# EAGLE design Espressomaschine (EAGLE 9.6.1)

## Sheet 1 of 4
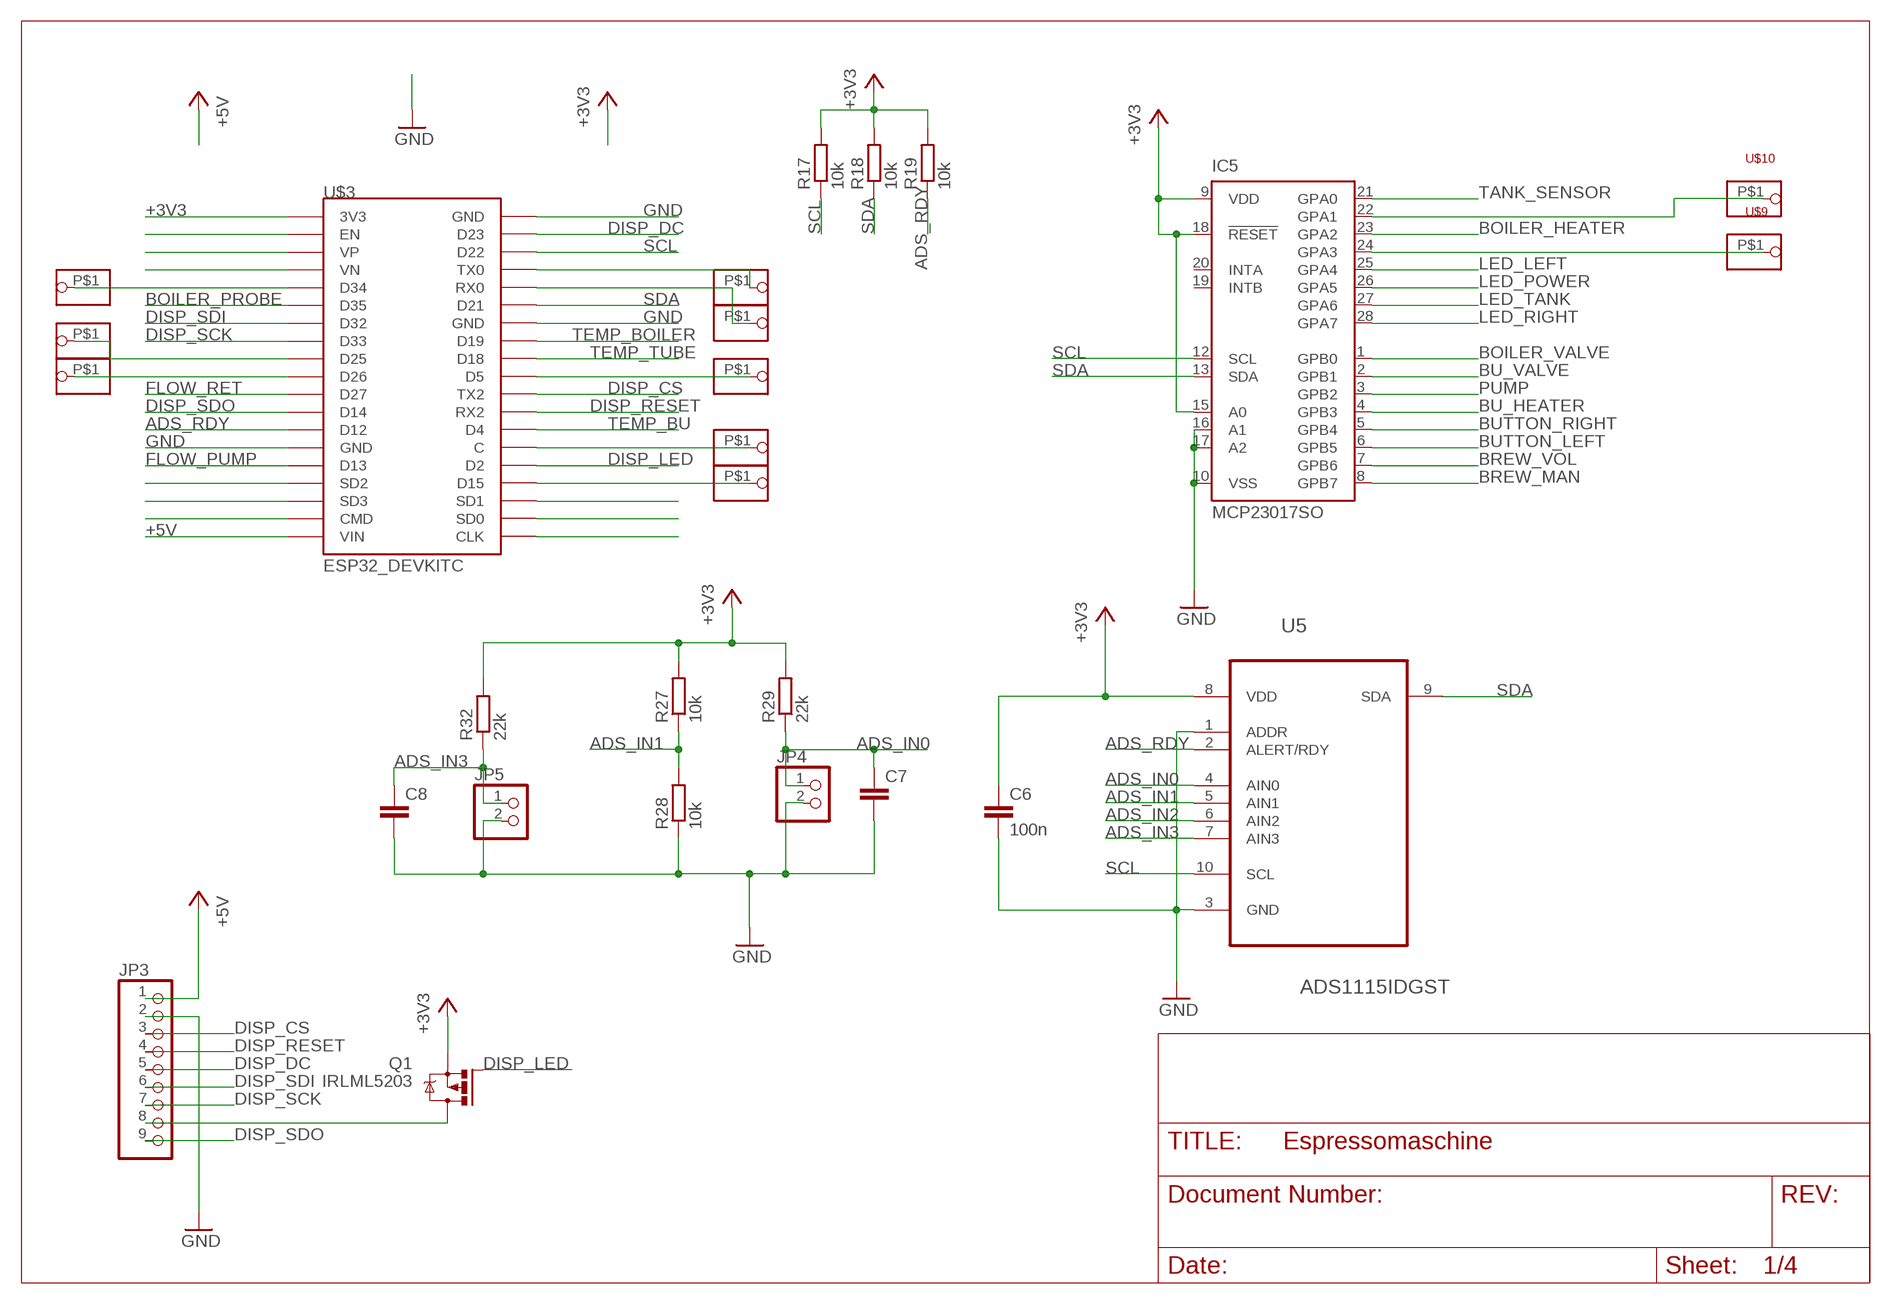
[diagram p0: schematic, sheet 1]

### Parts
C6  100n  C-EUC0603  [C0603]
C7  C-EUC0603  [C0603]
C8  C-EUC0603  [C0603]
IC5  MCP23017SO  [SO28W]
JP3  PINHD-1X9  [1X09]
JP4  PINHD-1X2  [1X02]
JP5  PINHD-1X2  [1X02]
Q1  IRLML5203  [MICRO3]
R17  10k  R-EU_R0603  [R0603]
R18  10k  R-EU_R0603  [R0603]
R19  10k  R-EU_R0603  [R0603]
R27  10k  R-EU_R0603  [R0603]
R28  10k  R-EU_R0603  [R0603]
R29  22k  R-EU_R0603  [R0603]
R32  22k  R-EU_R0603  [R0603]
U5  ADS1115IDGST  [SOP50P490X110-10N]
U$3  ESP32_DEVKITC  [ESP32_DEVKITC]
U$5  PINHD-1X1SMD_RM1.27  [1X01_SMD_RM1.27]
U$6  PINHD-1X1SMD_RM1.27  [1X01_SMD_RM1.27]
U$7  PINHD-1X1SMD_RM1.27  [1X01_SMD_RM1.27]
U$8  PINHD-1X1SMD_RM1.27  [1X01_SMD_RM1.27]
U$9  PINHD-1X1SMD_RM1.27  [1X01_SMD_RM1.27]
U$10  PINHD-1X1SMD_RM1.27  [1X01_SMD_RM1.27]
U$11  PINHD-1X1SMD_RM1.27  [1X01_SMD_RM1.27]
U$12  PINHD-1X1SMD_RM1.27  [1X01_SMD_RM1.27]
U$13  PINHD-1X1SMD_RM1.27  [1X01_SMD_RM1.27]
U$14  PINHD-1X1SMD_RM1.27  [1X01_SMD_RM1.27]

### Nets
+3V3: C6.1 IC5.9(VDD) IC5.15(A0) IC5.18(!RESET) Q1.2(S) R17.2 R18.2 R19.2 R27.2 R29.2 R32.2 U5.8(VDD) U$3.3V3 ; also sheet 2,3,4
+5V: JP3.1 U$3.VIN ; also sheet 2,3,4
ADS_IN0: C7.1 JP4.1 R29.1 U5.4(AIN0)
ADS_IN1: R27.1 R28.2 U5.5(AIN1)
ADS_IN2: U5.6(AIN2) ; also sheet 3
ADS_IN3: C8.1 JP5.1 R32.1 U5.7(AIN3)
ADS_RDY: R19.1 U5.2(ALERT/RDY) U$3.D12
BOILER_HEATER: IC5.23(GPA2) ; also sheet 2
BOILER_PROBE: U$3.D35 ; also sheet 3
BOILER_VALVE: IC5.1(GPB0) ; also sheet 2
BREW_MAN: IC5.8(GPB7) ; also sheet 2
BREW_VOL: IC5.7(GPB6) ; also sheet 2
BU_HEATER: IC5.4(GPB3) ; also sheet 2
BU_VALVE: IC5.2(GPB1) ; also sheet 2
BUTTON_LEFT: IC5.6(GPB5) ; also sheet 2
BUTTON_RIGHT: IC5.5(GPB4) ; also sheet 2
DISP_CS: JP3.3 U$3.TX2
DISP_DC: JP3.5 U$3.D23
DISP_LED: Q1.1(G) U$3.D2
DISP_RESET: JP3.4 U$3.RX2
DISP_SCK: JP3.7 U$3.D33
DISP_SDI: JP3.6 U$3.D32
DISP_SDO: JP3.9 U$3.D14
FLOW_PUMP: U$3.D13 ; also sheet 4
FLOW_RET: U$3.D27 ; also sheet 4
GND: C6.2 C7.2 C8.2 IC5.10(VSS) IC5.16(A1) IC5.17(A2) JP3.2 JP4.2 JP5.2 R28.1 U5.1(ADDR) U5.3(GND) U$3.GND@1(GND) U$3.GND@2(GND) U$3.GND@3(GND) ; also sheet 2,3,4
LED_LEFT: IC5.25(GPA4) ; also sheet 2
LED_POWER: IC5.26(GPA5) ; also sheet 2
LED_RIGHT: IC5.28(GPA7) ; also sheet 2
LED_TANK: IC5.27(GPA6) ; also sheet 2
N$4: U$3.C U$7.P$1
N$8: IC5.22(GPA1) U$10.P$1
N$19: IC5.24(GPA3) U$9.P$1
N$22: U$3.TX0 U$5.P$1
N$24: JP3.8 Q1.3(D)
N$26: U$3.RX0 U$11.P$1
N$31: U$3.D5 U$6.P$1
N$44: U$3.D15 U$8.P$1
N$45: U$3.SD1
N$46: U$3.SD0
N$47: U$3.CLK
N$49: U$3.EN
N$50: U$3.VP
N$51: U$3.VN
N$52: U$3.D34 U$12.P$1
N$56: U$3.D25 U$13.P$1
N$57: U$3.D26 U$14.P$1
N$63: U$3.SD2
N$64: U$3.SD3
N$65: U$3.CMD
PUMP: IC5.3(GPB2) ; also sheet 2
SCL: IC5.12(SCL) R17.1 U5.10(SCL) U$3.D22
SDA: IC5.13(SDA) R18.1 U5.9(SDA) U$3.D21
TANK_SENSOR: IC5.21(GPA0) ; also sheet 2
TEMP_BOILER: U$3.D19 ; also sheet 4
TEMP_BU: U$3.D4 ; also sheet 4
TEMP_TUBE: U$3.D18 ; also sheet 4
Unconnected: IC5.19(INTB) IC5.20(INTA)

## Sheet 2 of 4
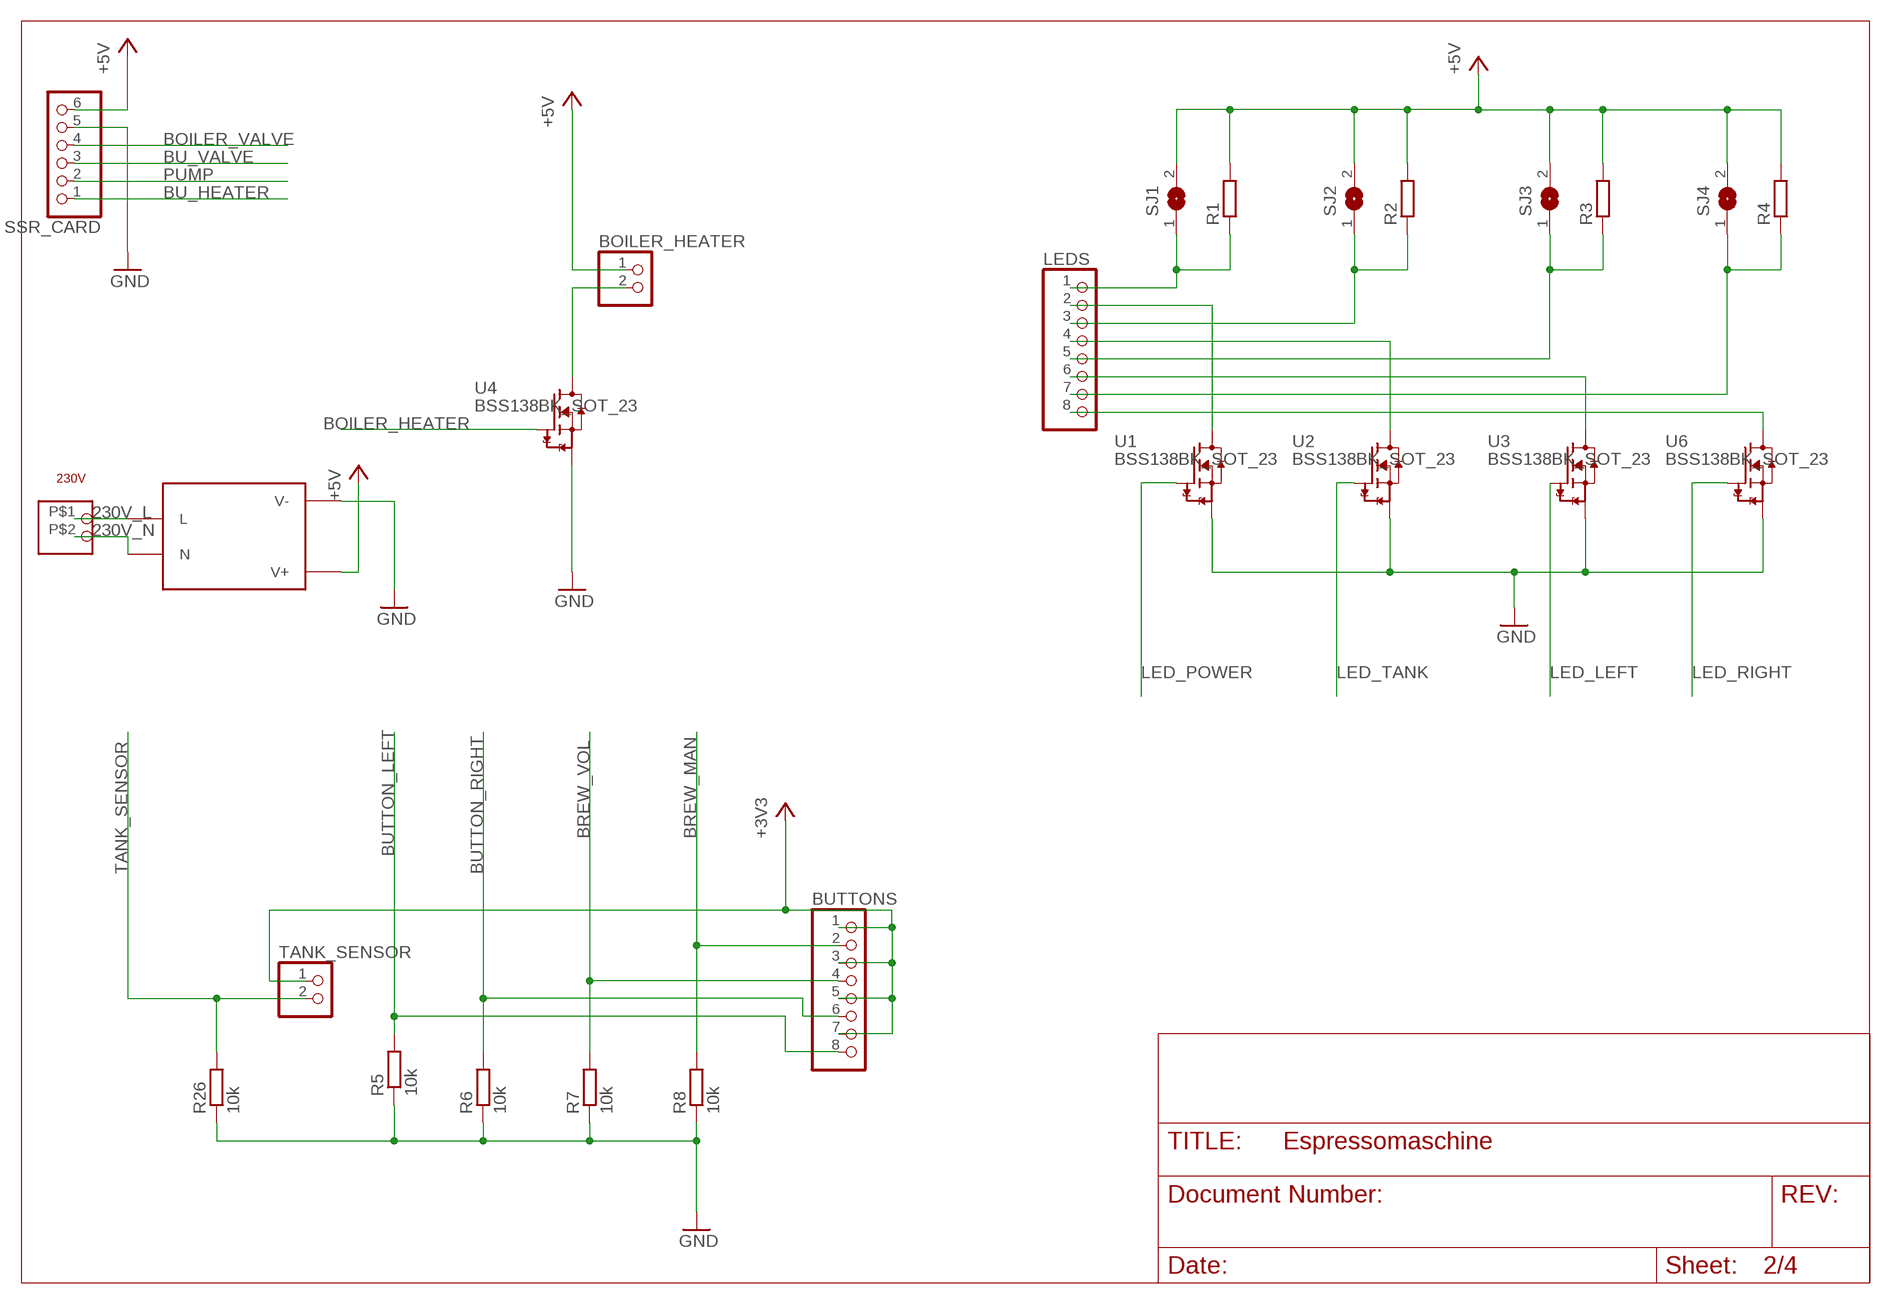
[diagram p1: schematic, sheet 2]

### Parts
230V  1X2RM5  [1X02_RM5]
BOILER_HEATER  PINHD-1X2  [1X02]
BUTTONS  PINHD-1X8  [1X08]
LEDS  PINHD-1X8  [1X08]
R1  R-EU_R0603  [R0603]
R2  R-EU_R0603  [R0603]
R3  R-EU_R0603  [R0603]
R4  R-EU_R0603  [R0603]
R5  10k  R-EU_R0603  [R0603]
R6  10k  R-EU_R0603  [R0603]
R7  10k  R-EU_R0603  [R0603]
R8  10k  R-EU_R0603  [R0603]
R26  10k  R-EU_R0603  [R0603]
SJ1  SJ  [SJ]
SJ2  SJ  [SJ]
SJ3  SJ  [SJ]
SJ4  SJ  [SJ]
SSR_CARD  PINHD-1X6  [1X06]
TANK_SENSOR  PINHD-1X2  [1X02]
U1  BSS138BK_SOT_23  [SOT23]
U2  BSS138BK_SOT_23  [SOT23]
U3  BSS138BK_SOT_23  [SOT23]
U4  BSS138BK_SOT_23  [SOT23]
U6  BSS138BK_SOT_23  [SOT23]
U$1  HLK-PM0X  [HLK-PM0X]

### Nets
230V_L: 230V.P$1 U$1.L
230V_N: 230V.P$2 U$1.N
+3V3: BUTTONS.1 BUTTONS.3 BUTTONS.5 BUTTONS.7 TANK_SENSOR.1 ; also sheet 1,3,4
+5V: BOILER_HEATER.1 R1.2 R2.2 R3.2 R4.2 SJ1.2 SJ2.2 SJ3.2 SJ4.2 SSR_CARD.6 U$1.V+ ; also sheet 1,3,4
BOILER_HEATER: U4.1(G) ; also sheet 1
BOILER_VALVE: SSR_CARD.4 ; also sheet 1
BREW_MAN: BUTTONS.2 R8.2 ; also sheet 1
BREW_VOL: BUTTONS.4 R7.2 ; also sheet 1
BU_HEATER: SSR_CARD.1 ; also sheet 1
BU_VALVE: SSR_CARD.3 ; also sheet 1
BUTTON_LEFT: BUTTONS.8 R5.2 ; also sheet 1
BUTTON_RIGHT: BUTTONS.6 R6.2 ; also sheet 1
GND: R5.1 R6.1 R7.1 R8.1 R26.1 SSR_CARD.5 U1.2(S) U2.2(S) U3.2(S) U4.2(S) U6.2(S) U$1.V- ; also sheet 1,3,4
LED_LEFT: U3.1(G) ; also sheet 1
LED_POWER: U1.1(G) ; also sheet 1
LED_RIGHT: U6.1(G) ; also sheet 1
LED_TANK: U2.1(G) ; also sheet 1
N$1: LEDS.1 R1.1 SJ1.1
N$2: LEDS.3 R2.1 SJ2.1
N$3: LEDS.5 R3.1 SJ3.1
N$5: LEDS.8 U6.3(D)
N$6: LEDS.6 U3.3(D)
N$7: BOILER_HEATER.2 U4.3(D)
N$9: LEDS.7 R4.1 SJ4.1
N$21: LEDS.4 U2.3(D)
N$23: LEDS.2 U1.3(D)
PUMP: SSR_CARD.2 ; also sheet 1
TANK_SENSOR: R26.2 TANK_SENSOR.2 ; also sheet 1

## Sheet 3 of 4
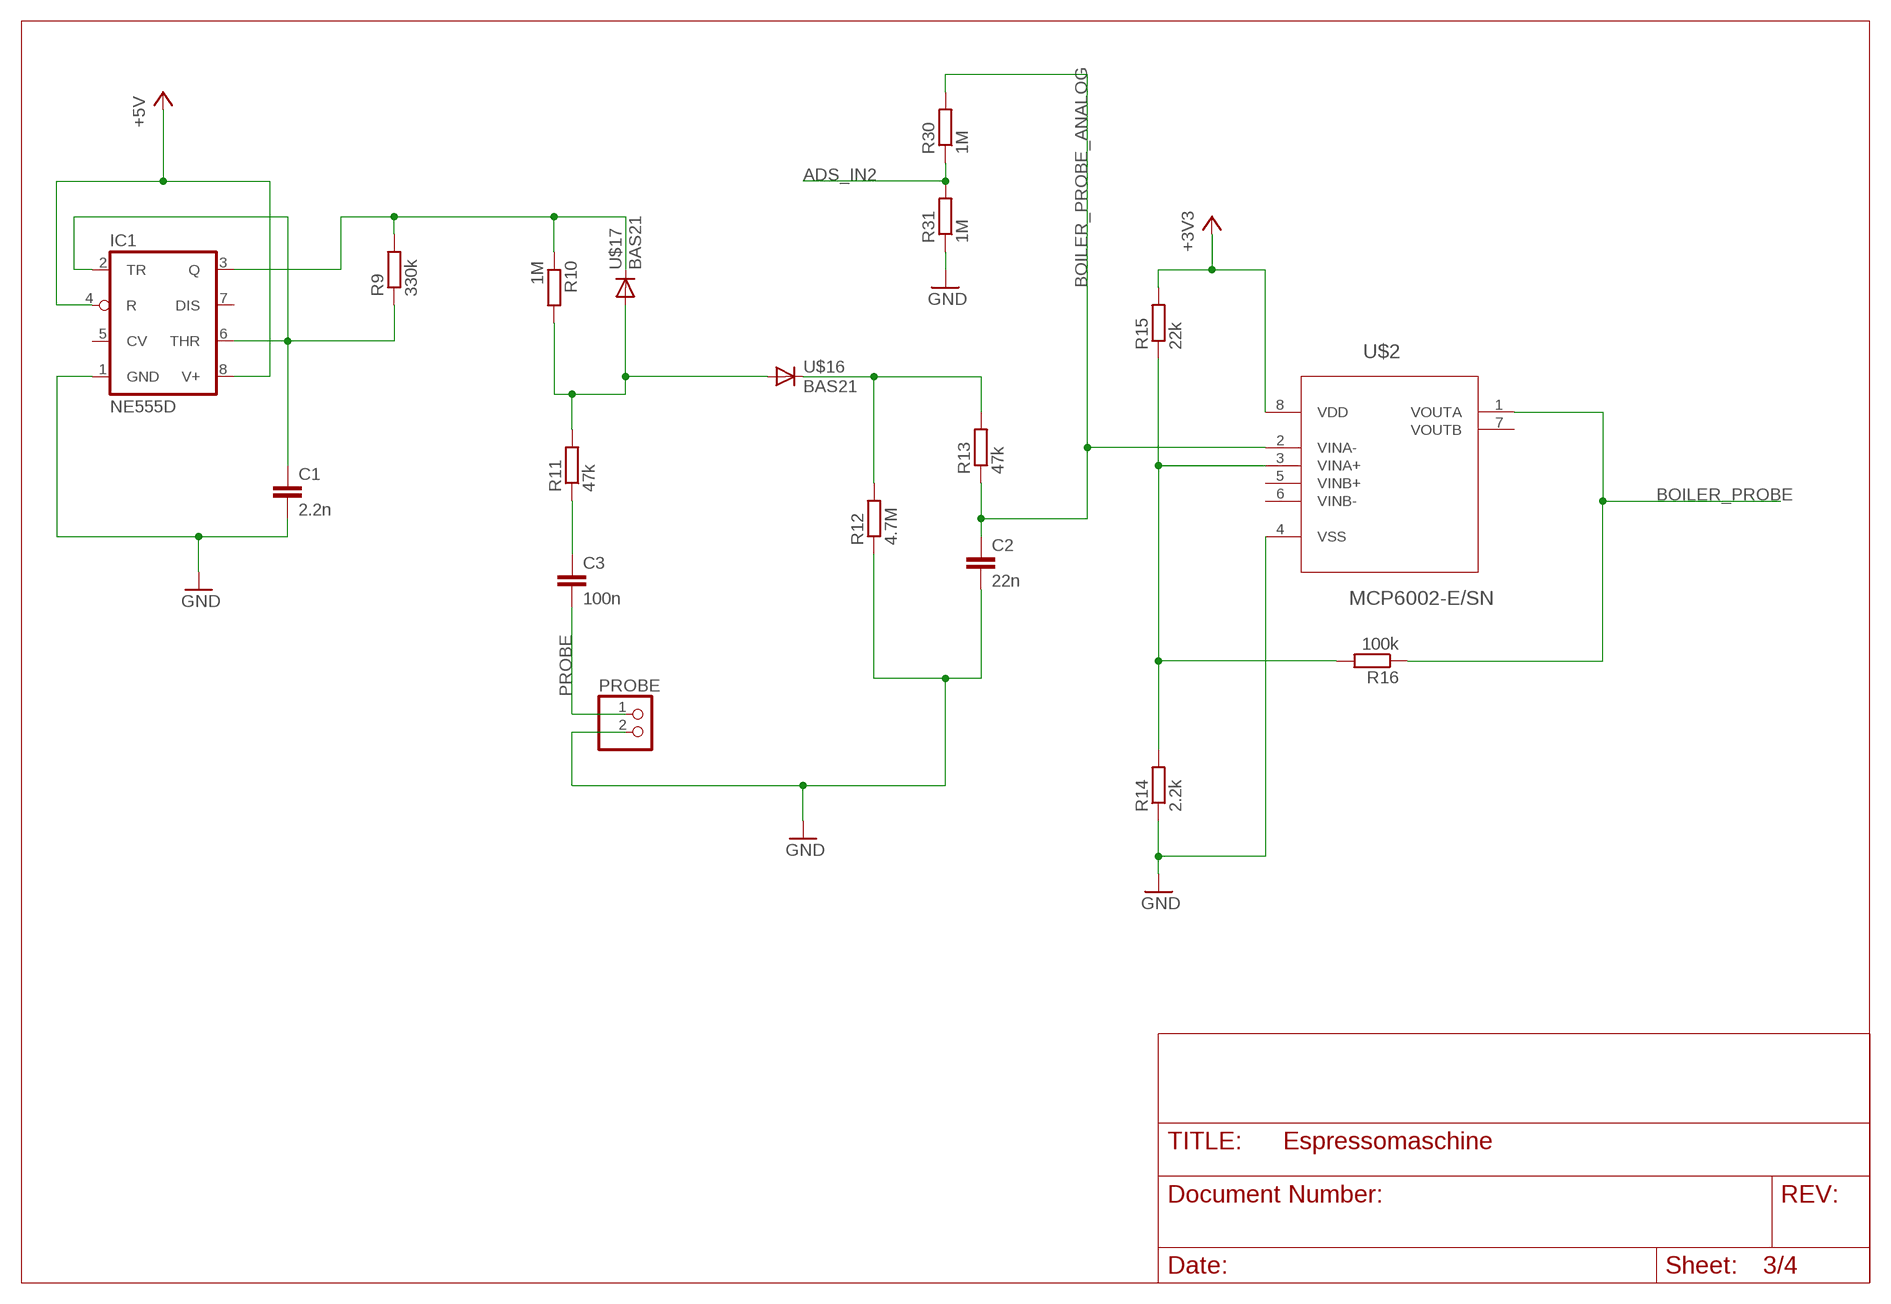
[diagram p2: schematic, sheet 3]

### Parts
C1  2.2n  C-EUC0603  [C0603]
C2  22n  C-EUC0603  [C0603]
C3  100n  C-EUC0603  [C0603]
IC1  NE555D  [SO08]
PROBE  PINHD-1X2  [1X02]
R9  330k  R-EU_R0603  [R0603]
R10  1M  R-EU_R0603  [R0603]
R11  47k  R-EU_R0603  [R0603]
R12  4.7M  R-EU_R0603  [R0603]
R13  47k  R-EU_R0603  [R0603]
R14  2.2k  R-EU_R0603  [R0603]
R15  22k  R-EU_R0603  [R0603]
R16  100k  R-EU_R0603  [R0603]
R30  1M  R-EU_R0603  [R0603]
R31  1M  R-EU_R0603  [R0603]
U$2  MCP6002-E/SN  [SOIC127P600X175-8N]
U$16  BAS21  [SOT23]
U$17  BAS21  [SOT23]

### Nets
+3V3: R15.2 U$2.8(VDD) ; also sheet 1,2,4
+5V: IC1.4(R) IC1.8(V+) ; also sheet 1,2,4
ADS_IN2: R30.1 R31.2 ; also sheet 1
BOILER_PROBE: R16.1 U$2.1(VOUTA) ; also sheet 1
BOILER_PROBE_ANALOG: C2.1 R13.1 R30.2 U$2.2(VINA-)
GND: C1.2 C2.2 IC1.1(GND) PROBE.2 R12.1 R14.1 R31.1 U$2.4(VSS) ; also sheet 1,2,4
N$10: C1.1 IC1.2(TR) IC1.6(THR) R9.1
N$11: R10.2 R11.2 U$16.1(A) U$17.1(A)
N$12: C3.1 R11.1
N$13: IC1.3(Q) R9.2 R10.1 U$17.3(C)
N$14: R12.2 R13.2 U$16.3(C)
N$16: R14.2 R15.1 R16.2 U$2.3(VINA+)
PROBE: C3.2 PROBE.1
Unconnected: IC1.5(CV) IC1.7(DIS) U$2.5(VINB+) U$2.6(VINB-) U$2.7(VOUTB)

## Sheet 4 of 4
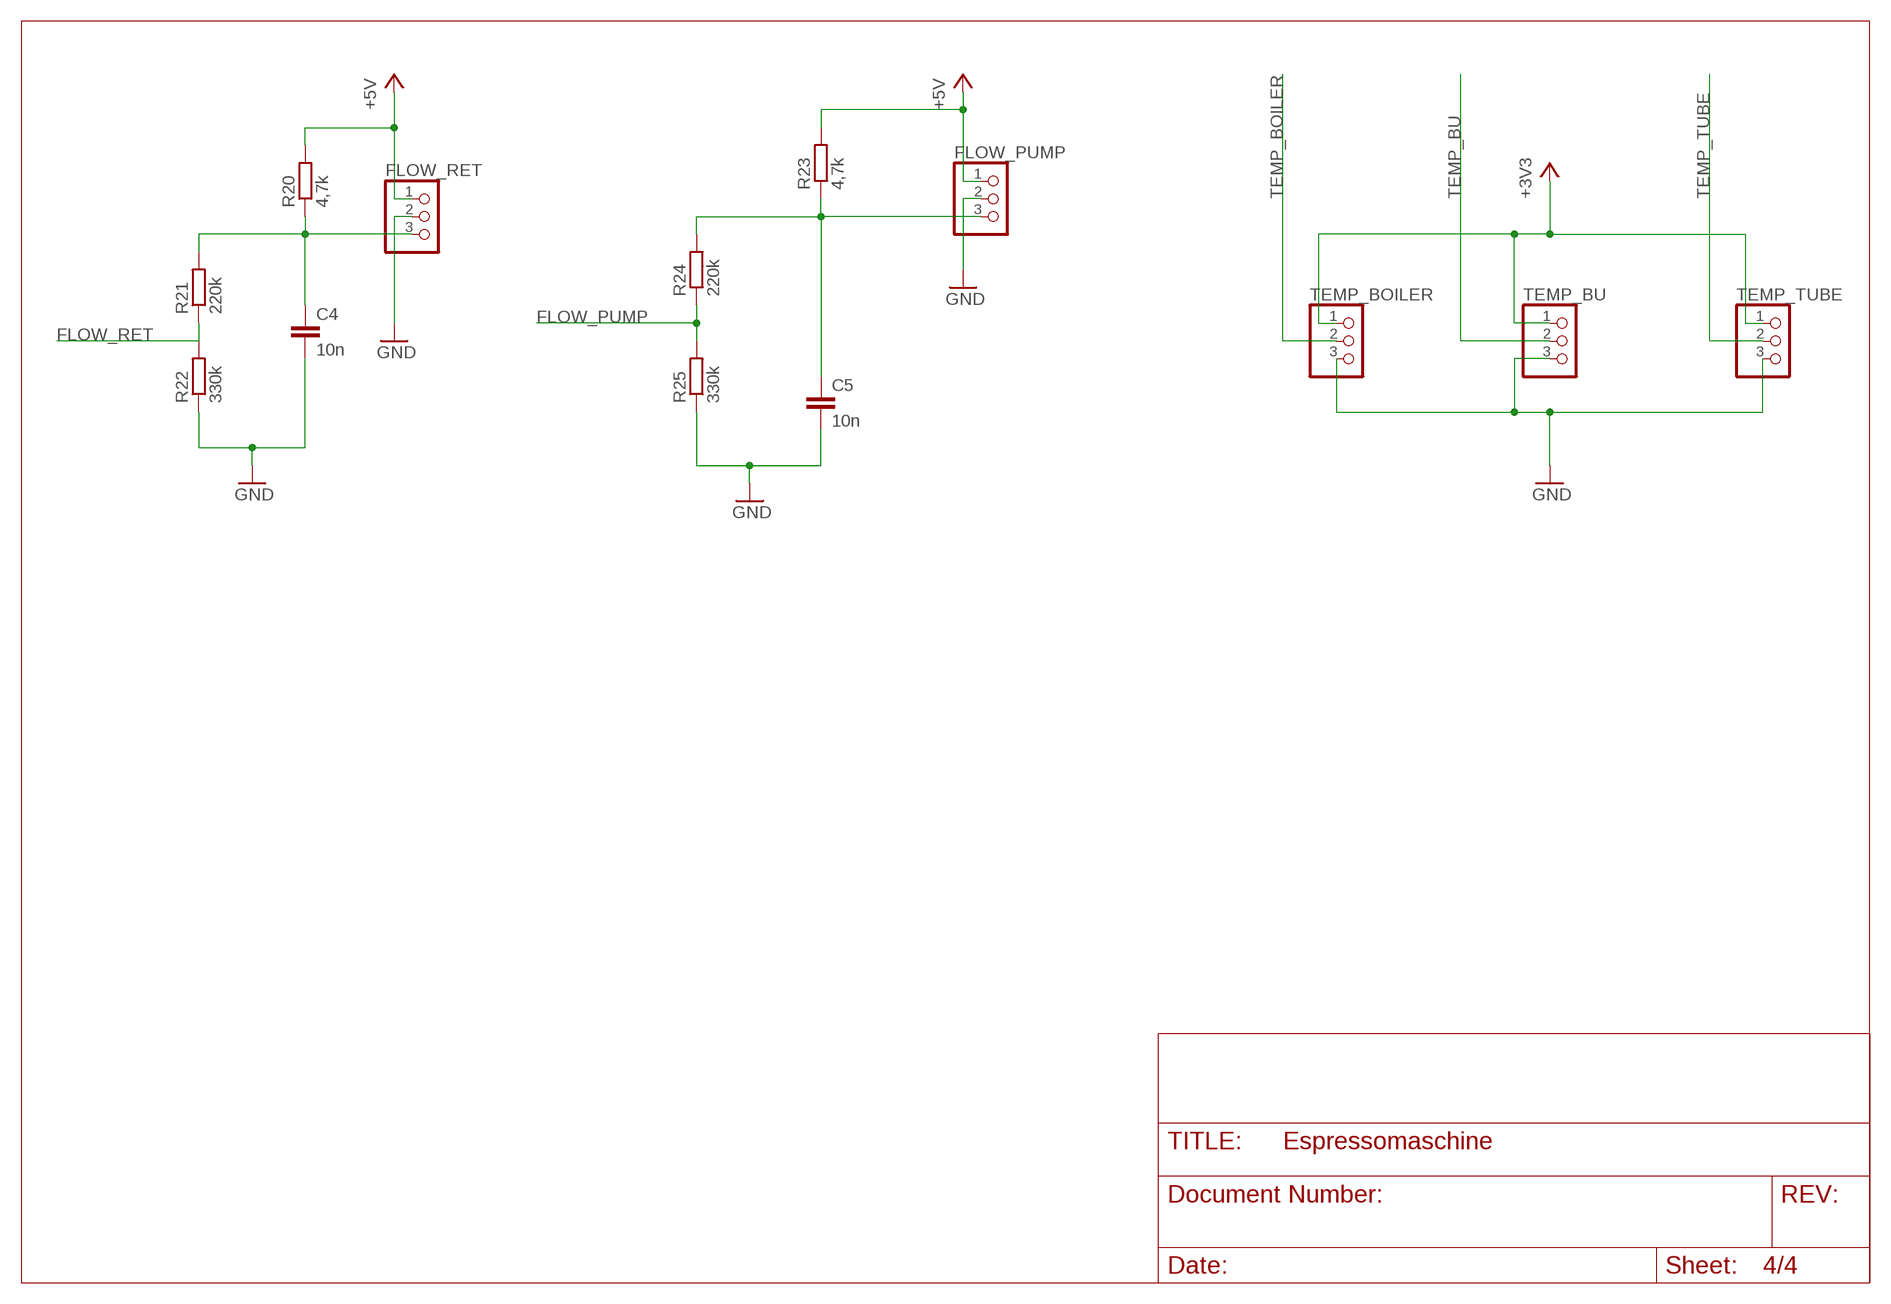
[diagram p3: schematic, sheet 4]

### Parts
C4  10n  C-EUC0603  [C0603]
C5  10n  C-EUC0603  [C0603]
FLOW_PUMP  PINHD-1X3  [1X03]
FLOW_RET  PINHD-1X3  [1X03]
R20  4,7k  R-EU_R0603  [R0603]
R21  220k  R-EU_R0603  [R0603]
R22  330k  R-EU_R0603  [R0603]
R23  4,7k  R-EU_R0603  [R0603]
R24  220k  R-EU_R0603  [R0603]
R25  330k  R-EU_R0603  [R0603]
TEMP_BOILER  PINHD-1X3  [1X03]
TEMP_BU  PINHD-1X3  [1X03]
TEMP_TUBE  PINHD-1X3  [1X03]

### Nets
+3V3: TEMP_BOILER.1 TEMP_BU.1 TEMP_TUBE.1 ; also sheet 1,2,3
+5V: FLOW_PUMP.1 FLOW_RET.1 R20.2 R23.2 ; also sheet 1,2,3
FLOW_PUMP: R24.1 R25.2 ; also sheet 1
FLOW_RET: R21.1 R22.2 ; also sheet 1
GND: C4.2 C5.2 FLOW_PUMP.2 FLOW_RET.2 R22.1 R25.1 TEMP_BOILER.3 TEMP_BU.3 TEMP_TUBE.3 ; also sheet 1,2,3
N$32: C4.1 FLOW_RET.3 R20.1 R21.2
N$33: C5.1 FLOW_PUMP.3 R23.1 R24.2
TEMP_BOILER: TEMP_BOILER.2 ; also sheet 1
TEMP_BU: TEMP_BU.2 ; also sheet 1
TEMP_TUBE: TEMP_TUBE.2 ; also sheet 1

## Library data of the parts
230V = PINHD_eigen:1X2RM5
BOILER_HEATER JP4 JP5 PROBE TANK_SENSOR = pinhead:PINHD-1X2: PIN HEADER
BUTTONS LEDS = pinhead:PINHD-1X8: PIN HEADER
C1-C8 = rcl:C-EU: CAPACITOR, European symbol; SPICEPREFIX: C
FLOW_PUMP FLOW_RET TEMP_BOILER TEMP_BU TEMP_TUBE = pinhead:PINHD-1X3: PIN HEADER
IC1 = linear:*555: TIMER
IC5 = microchip:MCP23017: http://ww1.microchip.com/downloads/en/DeviceDoc/21952a.pdf Source: http://ww1.microchip.com/downloads/en/DeviceDoc/21952a.pdf; MF: MICROCHIP; MPN: MCP23017-E/SO; OC_FARNELL: 1332087; OC_NEWARK: 31K2958
JP3 = pinhead:PINHD-1X9: PIN HEADER
Q1 = transistor-power:IRLML5203: HEXFET P-Channel Power MOSFET
R1-R32 = rcl:R-EU_: RESISTOR, European symbol; SPICEPREFIX: R
SJ1-SJ4 = jumper:SJ: SMD solder JUMPER
SSR_CARD = pinhead:PINHD-1X6: PIN HEADER
U1-U4 U6 = Transistor:BSS138BK: N-channel Trench MOSFET
U5 = Texas Instruments_By_element14_Batch_1:ADS1115IDGST: Analog-to-Digital Converter with Internal Reference; MPN: ADS1115IDGST; OC_FARNELL: 1762981; OC_NEWARK: 25R1241; PACKAGE: MSOP-10; SUPPLIER: Texas Instruments
U$1 = Power:HLK-PM0X: 230VAC to 5V/3.3V/12V DC converter
U$2 = Microchip_By_element14_Batch_1:MCP6002-E/SN: Low-Power Op Amp; DESCRIPTION: Low-Power Op Amp; MPN: MCP6002-E/SN; OC_FARNELL: 1332118; OC_NEWARK: 34M7473; PACKAGE: SOIC-8; SUPPLIER: Microchip
U$3 = ESP32:ESP32_DEVKITC: ESP32 DEVKIT BOARD
U$5-U$14 = PINHD_eigen:PINHD-1X1
U$16 U$17 = Diode:BAS21

## Board
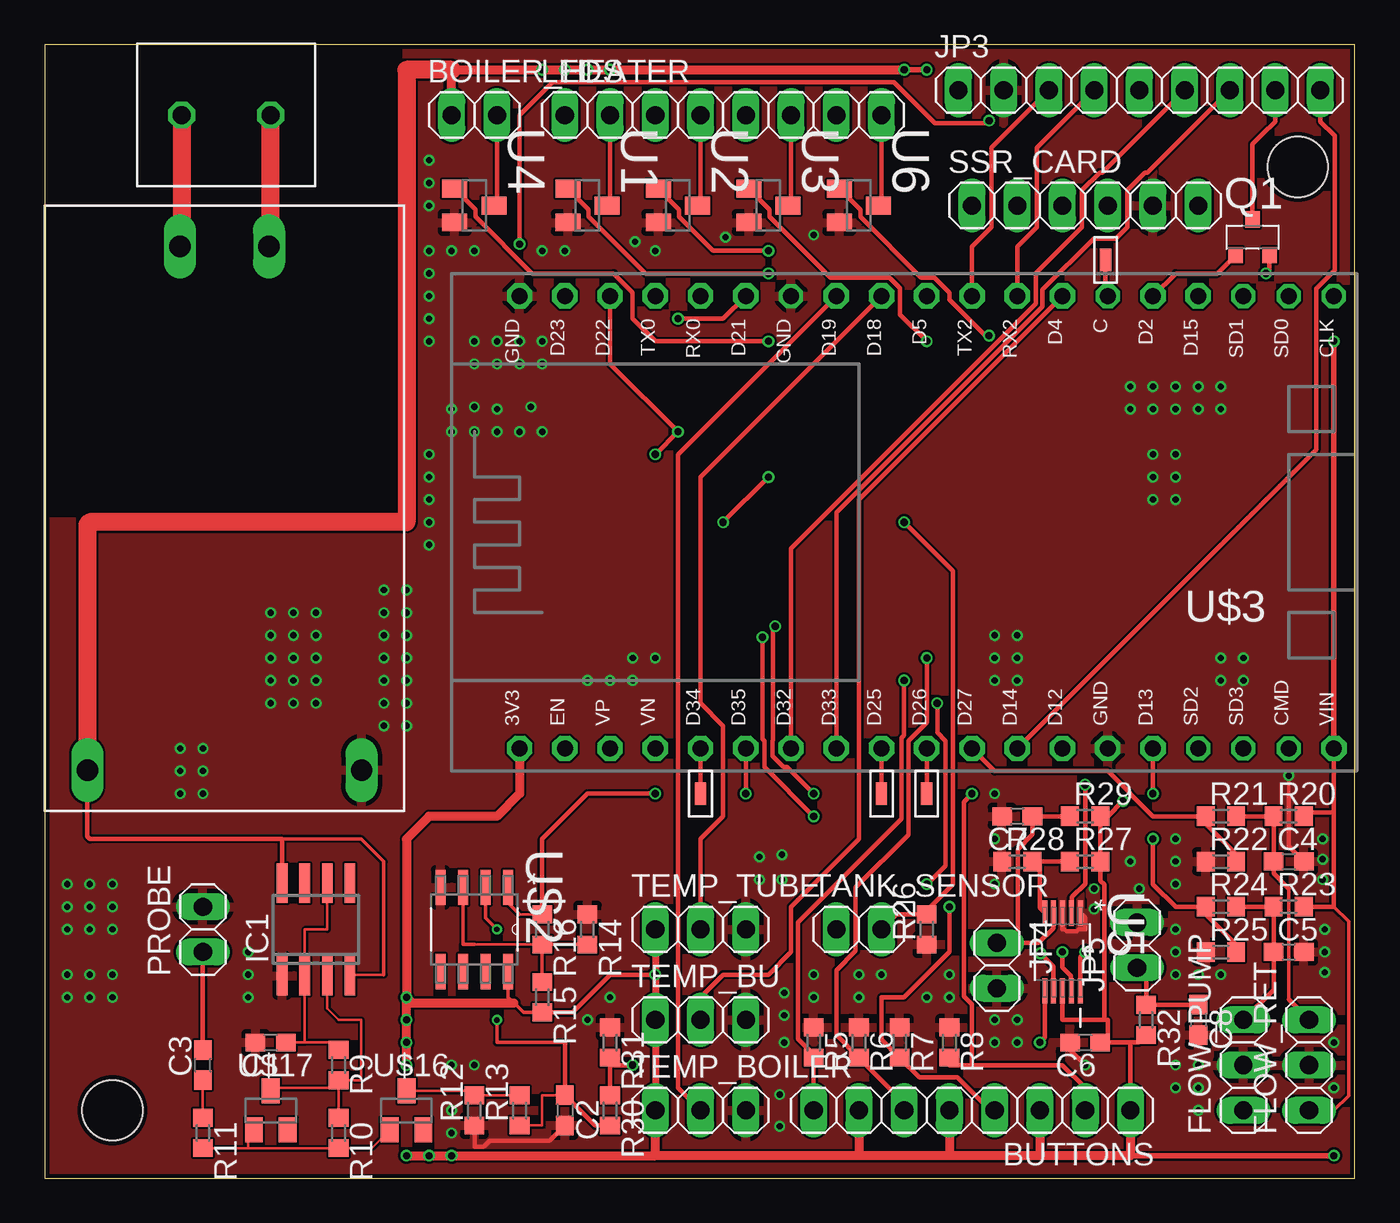
[diagram p4: board, top side]
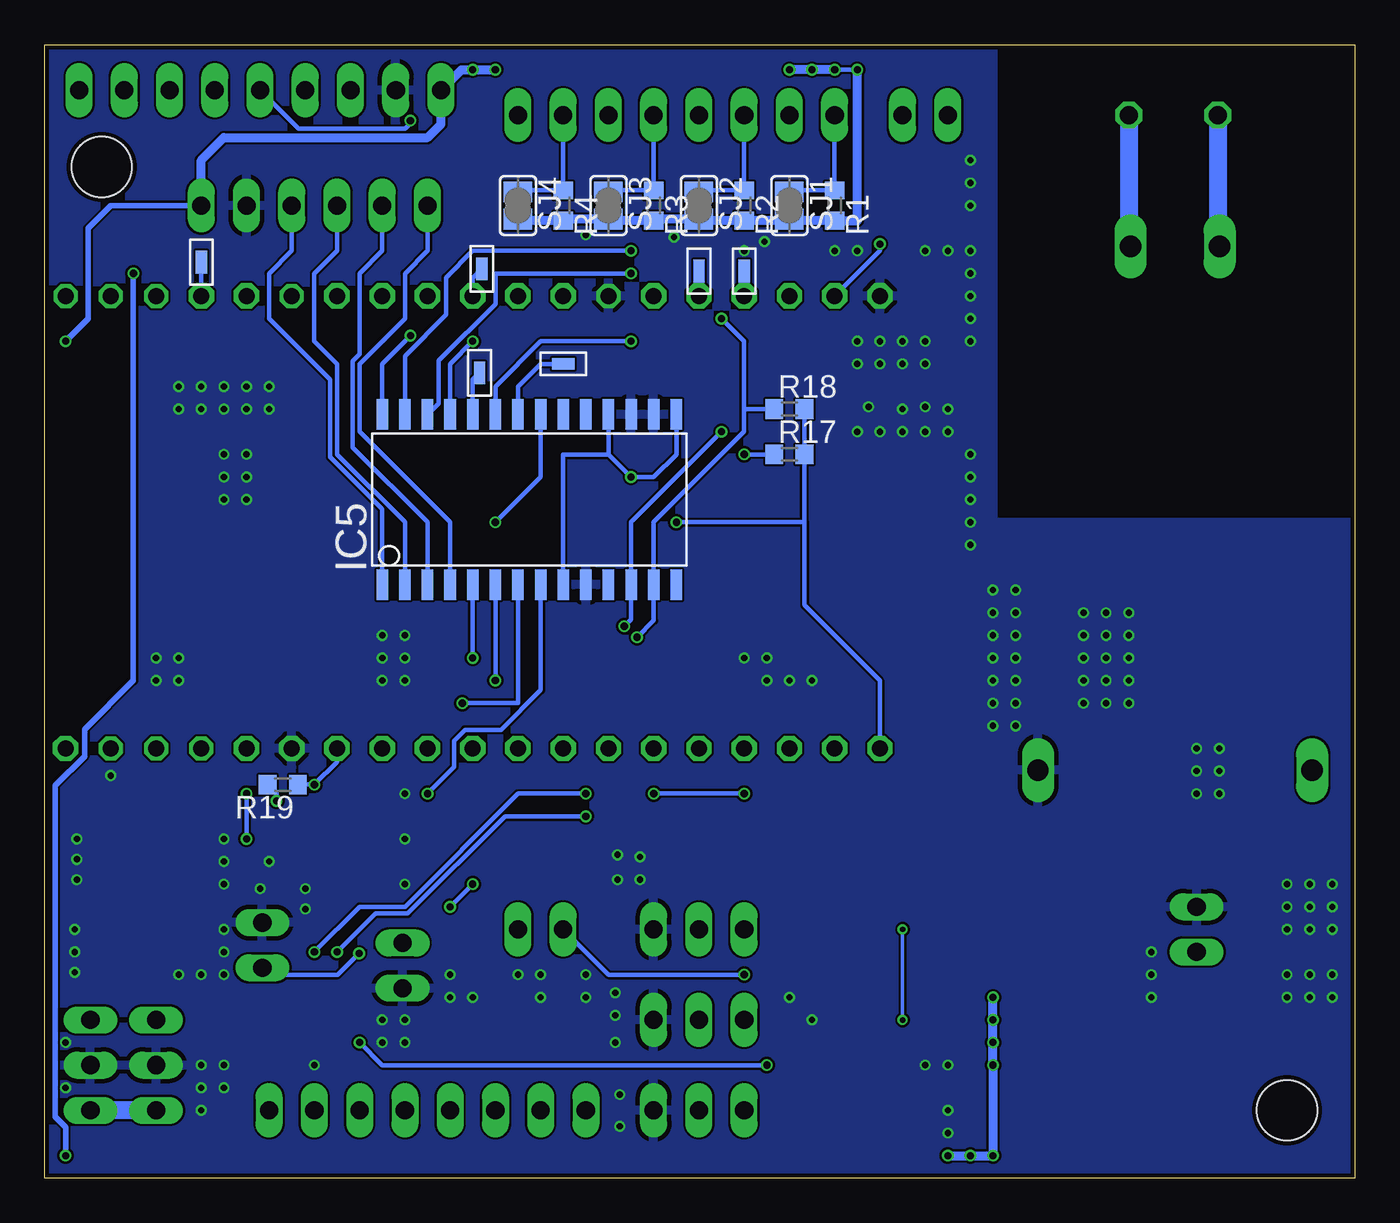
[diagram p5: board, bottom side, seen from below]

Size 73.57 x 63.65 mm. Coordinates in mm from the lower left corner, seen from the top.
Outline: 0,0 73.57,0 73.57,63.65 0,63.65 0,0
Copper layers (1*16): Top 0.035mm / dielectric 1.5mm / Bottom 0.035mm
Design rules "JLCpcb_2_layer *": minimum track width 5mil, minimum drill 0.2mm, track to track 5mil, track to pad 0.2mm, pad to pad 5mil, via to via 0.28mm, smd to smd 0mil, copper to edge 10mil, drill to drill 10mil, minimum pad ring 0.13mm, minimum via ring 0.13mm, stop-mask expansion 0.05mm, vias tented up to drill 100mil, thermal gap 10mil
Holes 3.4 mm at 3.81,3.81 70.36,56.77

### Footprints (pad centres in the part's own frame; a part is rotated, then mirrored left to right if it is on the bottom)
1X02_RM5 = drill 1 octagon: P$1 0,0; P$2 5,0
1X02 = drill 1.016 long: 1 -1.27,0; 2 1.27,0
1X08 = drill 1.016 long: 1 -8.89,0; 2 -6.35,0; 3 -3.81,0; 4 -1.27,0; 5 1.27,0; 6 3.81,0; 7 6.35,0; 8 8.89,0
C0603 = smd 1.1 x 1: 1 -0.85,0; 2 0.85,0
1X03 = drill 1.016 long: 1 -2.54,0; 2 0,0; 3 2.54,0
SO08 = smd 0.6 x 2.2: 1 -1.905,-2.6; 2 -0.635,-2.6; 3 0.635,-2.6; 4 1.905,-2.6; 5 1.905,2.6; 6 0.635,2.6; 7 -0.635,2.6; 8 -1.905,2.6
SO28W = smd 0.65 x 1.7: 1 -7.62,-4.78; 2 -6.35,-4.78; 3 -5.08,-4.78; 4 -3.81,-4.78; 5 -2.54,-4.78; 6 -1.27,-4.78; 7 0,-4.78; 8 1.27,-4.78; 9 2.54,-4.78; 10 3.81,-4.78; 11 5.08,-4.78; 12 6.35,-4.78; 13 7.62,-4.78; 14 8.89,-4.78; 15 8.89,4.78; 16 7.62,4.78; 17 6.35,4.78; 18 5.08,4.78; 19 3.81,4.78; 20 2.54,4.78; 21 1.27,4.78; 22 0,4.78; 23 -1.27,4.78; 24 -2.54,4.78; 25 -3.81,4.78; 26 -5.08,4.78; 27 -6.35,4.78; 28 -7.62,4.78
1X09 = drill 1.016 long: 1 -10.16,0; 2 -7.62,0; 3 -5.08,0; 4 -2.54,0; 5 0,0; 6 2.54,0; 7 5.08,0; 8 7.62,0; 9 10.16,0
MICRO3 = smd 0.8 x 0.9: 1 -0.95,-1; 2 0.95,-1; 3 0,1
R0603 = smd 1 x 1.1: 1 -0.85,0; 2 0.85,0
SJ = smd 1.168 x 1.6: 1 -0.762,0; 2 0.762,0
1X06 = drill 1.016 long: 1 -6.35,0; 2 -3.81,0; 3 -1.27,0; 4 1.27,0; 5 3.81,0; 6 6.35,0
SOT23 = smd 1 x 1.4: 1 -0.95,-1.1; 2 0.95,-1.1; 3 0,1.1
SOP50P490X110-10N = smd 1.422 x 0.279: 1 -2.184,0.991; 2 -2.184,0.508; 3 -2.184,0; 4 -2.184,-0.508; 5 -2.184,-0.991; 6 2.184,-0.991; 7 2.184,-0.508; 8 2.184,0; 9 2.184,0.508; 10 2.184,0.991
HLK-PM0X = drill 1.2 long: L 2.3,12.6; N 2.3,7.6; V+ 31.7,2.4; V- 31.7,17.8
SOIC127P600X175-8N = smd 1.981 x 0.559: 1 -2.362,1.905; 2 -2.362,0.635; 3 -2.362,-0.635; 4 -2.362,-1.905; 5 2.362,-1.905; 6 2.362,-0.635; 7 2.362,0.635; 8 2.362,1.905
ESP32_DEVKITC = drill 0.9 pad 1.422 octagon: 3V3 -13.97,20.32; D2 11.43,-15.24; D4 11.43,-10.16; D5 11.43,-2.54; D12 -13.97,-10.16; D13 -13.97,-15.24; D14 -13.97,-7.62; D15 11.43,-17.78; D18 11.43,0; D19 11.43,2.54; D21 11.43,7.62; D22 11.43,15.24; D23 11.43,17.78; D25 -13.97,0; D26 -13.97,-2.54; D27 -13.97,-5.08; D32 -13.97,5.08; D33 -13.97,2.54; D34 -13.97,10.16; D35 -13.97,7.62; EN -13.97,17.78; GND@1 -13.97,-12.7; GND@2 11.43,20.32; RX0 11.43,10.16; RX2 11.43,-7.62; TX0 11.43,12.7; TX2 11.43,-5.08; VIN -13.97,-25.4; VN -13.97,12.7; VP -13.97,15.24 | drill 0.9 octagon: C 11.43,-12.7; CLK 11.43,-25.4; CMD -13.97,-22.86; GND@3 11.43,5.08; SD0 11.43,-22.86; SD1 11.43,-20.32; SD2 -13.97,-17.78; SD3 -13.97,-20.32
1X01_SMD_RM1.27 = smd 1.27 x 0.635: P$1 0,0

### Placement (x,y rotation side)
230V  12.7,59.69 180 top
BOILER_HEATER  24.13,59.69 0 top
BUTTONS  52.07,3.81 180 top
C1  12.7,7.62 180 top
C2  29.21,3.81 270 top
C3  8.89,6.35 90 top
C4  69.85,17.78 0 top
C5  69.85,12.7 0 top
C6  58.42,7.62 180 top
C7  54.61,20.32 180 top
C8  64.77,8.89 270 top
FLOW_PUMP  67.31,6.35 90 top
FLOW_RET  70.99,6.35 90 top
IC1  15.24,13.97 0 top
IC5  46.99,38.1 0 bottom
JP3  61.47,61.09 0 top
JP4  53.47,11.94 270 top
JP5  61.34,13.08 90 top
LEDS  38.1,59.69 0 top
PROBE  8.89,13.97 90 top
Q1  67.82,52.83 0 top
R1  29.21,54.61 270 bottom
R2  34.29,54.61 270 bottom
R3  39.37,54.61 270 bottom
R4  44.45,54.61 270 bottom
R5  43.18,7.62 270 top
R6  45.72,7.62 270 top
R7  48.01,7.62 270 top
R8  50.8,7.62 270 top
R9  16.51,6.35 270 top
R10  16.51,2.54 270 top
R11  8.89,2.54 270 top
R12  24.13,3.81 90 top
R13  26.67,3.81 90 top
R14  30.48,13.97 270 top
R15  27.94,10.16 270 top
R16  27.94,13.97 270 top
R17  31.75,40.64 0 bottom
R18  31.75,43.18 0 bottom
R19  60.2,22.1 180 bottom
R20  69.85,20.32 0 top
R21  66.04,20.32 0 top
R22  66.04,17.78 0 top
R23  69.85,15.24 0 top
R24  66.04,15.24 0 top
R25  66.04,12.7 0 top
R26  49.53,13.97 90 top
R27  58.42,17.78 0 top
R28  54.61,17.78 0 top
R29  58.42,20.32 0 top
R30  31.75,3.81 270 top
R31  31.75,7.62 270 top
R32  61.85,8.89 270 top
SJ1  31.75,54.61 270 bottom
SJ2  36.83,54.61 270 bottom
SJ3  41.91,54.61 270 bottom
SJ4  46.99,54.61 270 bottom
SSR_CARD  58.42,54.61 0 top
TANK_SENSOR  45.72,13.97 0 top
TEMP_BOILER  36.83,3.81 0 top
TEMP_BU  36.83,8.89 0 top
TEMP_TUBE  36.83,13.97 0 top
U1  30.48,54.61 270 top
U2  35.56,54.61 270 top
U3  40.64,54.61 270 top
U4  24.13,54.61 270 top
U5  57.15,12.7 270 top
U6  45.72,54.61 270 top
U$1  0,54.61 270 top
U$2  24.13,13.97 270 top
U$3  46.99,38.1 90 top
U$5  34.29,50.93 270 bottom
U$6  49.02,51.05 270 bottom
U$7  59.56,51.56 90 top
U$8  64.77,51.43 270 bottom
U$9  49.15,45.21 270 bottom
U$10  44.45,45.72 0 bottom
U$11  36.83,50.93 90 bottom
U$12  36.83,21.59 90 top
U$13  46.99,21.59 90 top
U$14  49.53,21.59 90 top
U$16  20.32,3.81 0 top
U$17  12.7,3.81 0 top

### Tracks (layer width: path | path; a pad name or v marks a point on that pad's centre or on a via)
230V_L
  Top 1.016: 230V.P$1 12.7,53.34 12.6,53.24 U$1.L
  Bottom 1.016: 230V.P$1 12.7,52.41 U$1.L
230V_N
  Top 1.016: 230V.P$2 7.7,52.41 U$1.N
  Bottom 1.016: 230V.P$2 7.7,53.42 | 7.7,53.42 7.62,53.34 | U$1.N 7.62,52.29 7.62,52.07 7.7,52.15 7.7,53.42
+3V3  (via drill 0.4)
  Top 0.2: U$2.8 26.04,10.16 26.35,9.84 26.88,9.31 R15.2
  Top 0.254: U5.8 57.15,8.89 59.49,8.89 | 59.69,7.62 60.96,7.62 | 59.69,7.62 C6.1 | BUTTONS.1 60.96,7.62 | 59.69,7.62 59.69,8.89 59.49,8.89 | R15.2 29.63,9.31 31.75,11.43 v34.29,11.43 | v40.64,39.37 v38.1,36.83 | v20.32,10.16 v20.32,8.89 v20.32,7.62 | v21.59,1.27 v22.86,1.27 | R32.2 61.43,7.62 60.96,7.62 | 59.49,8.89 59.49,16.49 59.27,16.7 R27.2 R29.2 59.69,20.32 v60.55,21.18 | Q1.2 68.77,50.99 v68.58,50.8
  Top 0.305: 60.96,1.27 v72.39,1.27
  Top 0.406: TEMP_TUBE.1 v34.29,11.43 TEMP_BU.1 TEMP_BOILER.1
  Top 0.508: BUTTONS.1 60.96,1.27 55.88,1.27 | 55.88,1.27 50.8,1.27 | 50.8,1.27 45.72,1.27 | 45.72,1.27 34.29,1.27 | 34.29,1.27 TEMP_BOILER.1 | BUTTONS.7 45.72,1.27 | BUTTONS.5 50.8,1.27 | BUTTONS.3 55.88,1.27 | U$3.3V3 26.67,21.59 25.4,20.32 21.59,20.32 20.32,19.05 v20.32,10.16 | v20.32,10.16 20.64,9.84 26.35,9.84 | v20.32,1.27 v22.86,1.27 34.29,1.27 | v20.32,6.35 v20.32,7.62 v20.32,10.16
  Bottom 0.254: TANK_SENSOR.1 41.91,11.43 v34.29,11.43 | R18.2 R17.2 30.9,36.83 | 30.9,36.83 30.9,32.17 26.67,27.94 U$3.3V3 | IC5.18 41.91,40.64 | 41.91,40.64 v40.64,39.37 39.37,39.37 38.1,40.64 IC5.15 | v38.1,36.83 30.9,36.83 | IC5.9 44.45,40.64 41.91,40.64 | R19.2 60.55,21.6 v60.55,21.18
  Bottom 0.305: v72.39,1.27 72.39,2.87 72.97,3.45 72.97,22.04 71.33,23.69 71.33,25.19 68.58,27.94 v68.58,50.8
  Bottom 0.508: v20.32,10.16 v20.32,6.35 v20.32,1.27 v22.86,1.27
+5V  (via drill 0.4)
  Top 0.152: 19.05,11.43 17.14,11.43 IC1.4
  Top 0.2: 72.39,15.24 73.22,14.41 73.22,4.64 72.39,3.81 FLOW_RET.1 | 13.34,19.05 17.78,19.05 19.05,17.78 19.05,11.43
  Top 0.254: IC1.8 13.34,19.05 2.54,19.05 2.4,19.19 2.4,22.86 U$1.V+ | R20.2 70.91,20.53 72.39,20.53 | R23.2 72.39,15.24 72.39,20.32 72.39,20.53 | 72.39,20.53 U$3.VIN
  Top 0.305: U$3.VIN v72.39,46.99 | v48.26,62.23 v49.53,62.23
  Top 0.508: v48.26,62.23 v27.94,62.23 22.86,62.23 BOILER_HEATER.1
  Top 1.016: 22.86,62.23 20.32,62.23 20.32,36.83 2.54,36.83 2.4,36.69 2.4,22.86
  Bottom 0.254: v27.94,62.23 v29.21,62.23 | v30.48,62.23 v31.75,62.23
  Bottom 0.305: SSR_CARD.6 69.85,54.61 71.12,53.34 71.12,48.26 v72.39,46.99
  Bottom 0.508: SJ4.2 46.9,53.76 R4.2 44.36,53.85 SJ3.2 41.82,53.76 R3.2 39.28,53.85 SJ2.2 36.74,53.76 R2.2 31.84,53.76 SJ1.2 31.66,53.76 R1.2 27.94,53.76 v27.94,62.23 | v29.21,62.23 v31.75,62.23 | SSR_CARD.6 64.77,57.15 63.5,58.42 52.07,58.42 51.31,59.18 JP3.1 50.16,62.23 v48.26,62.23
  Bottom 1.016: FLOW_PUMP.1 FLOW_RET.1
ADS_IN0
  Top 0.254: R29.1 C7.1 55.46,19.29 54.63,18.47 54.63,13.23 54.61,13.21 | U5.4 56.63,14.87 56.63,14.04 55.8,13.21 54.61,13.21 | 54.61,13.21 JP4.1
ADS_IN1
  Top 0.254: R28.2 55.88,17.78 | 55.88,17.78 R27.1 | U5.5 55.88,15.16 55.88,17.78
ADS_IN2  (via drill 0.4)
  Top 0.254: R30.1 31.75,6.35 | 31.75,6.35 R31.2 | U5.6 56.16,7.9 v55.88,7.62 | v33.02,6.35 31.75,6.35
  Bottom 0.254: v55.88,7.62 54.61,6.35 v33.02,6.35
ADS_IN3  (via drill 0.4)
  Top 0.254: U5.7 56.64,11.9 v55.91,12.62 | JP5.1 61.85,11.3 R32.1 C8.1
  Bottom 0.254: v55.91,12.62 57.11,11.43 60.96,11.43 JP5.1
ADS_RDY  (via drill 0.4)
  Top 0.254: U5.2 57.67,14.9 57.67,15.79 58.42,16.54 v58.42,22.1
  Bottom 0.254: U$3.D12 57.15,23.37 v58.42,22.1 R19.1
BOILER_HEATER  (via drill 0.4)
  Top 0.254: U4.1 24.2,54.39 24.2,53.98 27.38,50.8 31.95,50.8 33.02,49.73 33.02,48.26 34.29,46.99 v40.64,46.99
  Bottom 0.254: v40.64,46.99 45.72,46.99 48.26,44.45 IC5.23
BOILER_PROBE  (via drill 0.4)
  Top 0.152: 26.67,14.82 R16.1
  Top 0.2: U$2.1 26.04,15.46 26.67,14.82
  Top 0.254: R16.1 27.94,19.05 30.48,21.59 v34.29,21.59 | v39.37,21.59 U$3.D35
  Bottom 0.254: v34.29,21.59 v39.37,21.59
BOILER_PROBE_ANALOG  (via drill 0.3)
  Top 0.152: R13.1 27.94,2.96 27.94,4.66 C2.1
  Top 0.2: U$2.2 24.77,14.6 v25.4,13.97 | v25.4,8.89 25.4,7.62 29.21,7.62
  Top 0.254: 29.21,7.62 C2.1 30.91,2.96 R30.2
  Bottom 0.2: v25.4,13.97 v25.4,8.89
BOILER_VALVE
  Bottom 0.254: SSR_CARD.4 59.69,52.07 60.96,50.8 60.96,48.26 57.53,44.83 57.53,40.48 54.61,37.56 IC5.1
BREW_MAN  (via drill 0.4)
  Top 0.254: BUTTONS.2 58.42,5.08 57.15,6.35 52.07,6.35 | R8.2 50.8,6.35 52.07,6.35 | 52.07,6.35 52.07,9.76 51.62,10.22 51.62,21.14 v52.07,21.59
  Bottom 0.254: v52.07,21.59 50.57,23.09 50.57,24.56 49.96,25.17 47.95,25.17 45.72,27.4 IC5.8
BREW_VOL  (via drill 0.4)
  Top 0.254: BUTTONS.4 53.1,3.81 51.25,5.66 49.12,5.66 R7.2 46.99,7.79 46.99,10.16 48.26,10.16 50.8,12.7 v50.8,15.24 | v50.11,26.67 50.11,25.01 50.57,24.56 50.57,17.55 v49.53,16.51
  Bottom 0.254: IC5.7 46.99,26.67 v50.11,26.67 | v49.53,16.51 v50.8,15.24
BU_HEATER
  Bottom 0.254: SSR_CARD.1 52.07,52.07 53.34,50.8 53.34,48.26 55.88,45.72 55.88,41.91 50.8,36.83 IC5.4
BU_VALVE
  Bottom 0.254: SSR_CARD.3 57.15,52.07 58.42,50.8 58.42,46.99 57.15,45.72 57.15,40.64 53.34,36.83 IC5.2
BUTTON_LEFT  (via drill 0.4)
  Top 0.254: BUTTONS.8 R5.2 43.18,6.96 42.3,7.84 42.3,14.36 48.11,20.17 48.11,24.72 48.26,24.87 v48.26,27.94
  Bottom 0.254: v48.26,27.94 IC5.6
BUTTON_RIGHT  (via drill 0.4)
  Top 0.254: BUTTONS.6 48.26,4.23 R6.2 44.45,8.04 44.45,11.67 45.54,12.76 45.54,16.33 48.49,19.28 48.49,24.56 49.53,25.6 v49.53,29.21
  Bottom 0.254: v49.53,29.21 IC5.5
DISP_CS
  Top 0.254: U$3.TX2 52.07,52.31 53.16,53.4 53.16,57.86 JP3.3
DISP_DC  (via drill 0.4)
  Top 0.254: v26.67,52.45 26.67,59.69 28.52,61.54 47.68,61.54 49.98,59.24 52.89,59.24 v53.03,59.38
  Bottom 0.254: JP3.5 59.31,58.93 53.34,58.93 53.03,59.24 v53.03,59.38 | v26.67,52.45 26.67,52.07 U$3.D23
DISP_LED
  Top 0.254: U$3.D2 63.5,50.8 65.84,50.8 Q1.1
DISP_RESET
  Top 0.254: U$3.RX2 54.61,52.31 55.7,53.4 55.7,57.86 JP3.4
DISP_SCK
  Top 0.254: JP3.7 61.92,56.46 61.78,56.46 60.78,55.46 60.78,53.4 60.14,52.76 58.91,52.76 56.03,49.88 56.03,48.94 49.9,42.81 44.45,37.36 U$3.D33
DISP_SDI
  Top 0.254: JP3.6 59.38,56.46 59.24,56.46 58.24,55.46 58.24,53.4 55.65,50.81 55.65,49.1 49.63,43.08 47.09,40.54 41.91,35.36 U$3.D32
DISP_SDO
  Top 0.254: U$3.D14 71.39,40.91 71.39,49.95 72.44,51 72.44,58.52 71.63,59.33 JP3.9
FLOW_PUMP  (via drill 0.4)
  Top 0.254: R25.2 66.89,13.12 65.19,14.82 R24.1 63.5,15.24 62.23,16.51 v62.23,19.05 | v62.23,21.59 U$3.D13
  Bottom 0.254: v62.23,19.05 v62.23,21.59
FLOW_RET
  Top 0.254: R22.2 66.89,18.2 65.19,19.9 R21.1 62.23,20.32 59.69,22.86 53.34,22.86 U$3.D27
GND  (via drill 0.35)
  Top 0.2: 69.85,21.59 v69.85,22.61
  Top 0.254: C4.2 69.85,18.63 69.85,21.59 | U5.3 57.15,13.97 57.26,13.97 57.38,13.85 57.93,13.85 58.06,13.97 58.42,13.97 58.42,14.6 U5.1 | C2.2 28.37,2.12 24.98,2.12 24.64,1.78 24.13,1.78 R12.1 | C6.2 57.57,7.2 v58.42,6.35
  other vias: 20.32,25.4 20.32,26.67 20.32,27.94 20.32,29.21 20.32,30.48 20.32,31.75 20.32,33.02 19.05,33.02 19.05,31.75 19.05,30.48 19.05,29.21 19.05,27.94 19.05,26.67 19.05,25.4 24.13,45.72 25.4,45.72 26.67,45.72 27.94,45.72 27.94,46.99 26.67,46.99 25.4,46.99 24.13,46.99 21.59,38.1 21.59,36.83 21.59,35.56 21.59,39.37 21.59,40.64 31.75,27.94 30.48,27.94 61.47,16.26 11.43,12.7 11.43,11.43 11.43,10.16 45.72,11.43 49.53,10.16 50.8,11.43 50.8,10.16 46.99,11.43 45.72,10.16 2.54,11.43 3.81,10.16 1.27,11.43 1.27,10.16 2.54,10.16 3.81,11.43 54.61,8.89 53.34,7.62 58.93,15.11 58.93,16.26 54.61,7.62 53.34,8.89 66.04,11.43 64.77,3.81 63.5,13.97 60.96,17.78 24.13,6.35 22.86,6.35 22.86,3.81 22.86,2.54 27.94,52.07 24.13,52.07 38.23,52.83 34.29,52.07 29.21,52.07 22.86,52.07 43.18,52.96 66.04,29.21 66.04,27.94 67.31,27.94 67.31,29.21 33.15,52.58 40.13,16.76 41.4,16.76 40.13,18.03 41.4,18.16 62.23,40.64 62.23,39.37 62.23,38.1 63.5,38.1 63.5,39.37 63.5,40.64 63.5,11.43 64.77,6.35 63.5,12.7 63.5,16.51 41.53,10.41 30.48,8.89 41.27,2.92 41.27,4.7 41.53,7.62 41.53,9.14 8.89,21.59 8.89,22.86 8.89,24.13 7.62,24.13 7.62,22.86 7.62,21.59 21.59,48.26 21.59,46.99 21.59,52.07 21.59,50.8 21.59,57.15 21.59,55.88 21.59,54.61 21.59,49.53 60.96,43.18 22.86,43.18 62.23,43.18 24.13,41.91 24.13,43.31 62.23,44.45 60.96,44.45 26.67,41.91 27.94,41.91 66.04,43.18 22.86,41.91 25.4,41.91 25.4,43.18 63.5,43.18 63.5,44.45 64.77,44.45 64.77,43.18 33.02,27.94 33.02,29.21 34.29,29.21 53.34,30.48 54.61,30.48 54.61,27.94 54.61,29.21 53.34,29.21 53.34,27.94 71.75,17.91 72.39,7.62 63.5,17.78 63.5,5.08 63.5,6.35 63.5,19.05 71.75,16.76 71.88,12.7 71.75,19.05 71.88,13.97 71.88,11.56 2.54,13.97 53.34,21.59 43.18,11.43 43.18,10.16 31.75,10.16 1.27,13.97 1.27,16.51 2.54,16.51 3.81,16.51 3.81,15.24 2.54,15.24 1.27,15.24 3.81,13.97 53.34,16.51 53.34,19.05 12.7,31.75 13.97,31.75 15.24,31.75 15.24,30.48 13.97,30.48 12.7,30.48 12.7,29.21 13.97,29.21 15.24,29.21 15.24,27.94 13.97,27.94 12.7,27.94 12.7,26.67 13.97,26.67 15.24,26.67 27.3,43.31 72.39,5.08 64.77,5.08 64.77,11.43 66.04,44.45
  pour Top: 0,0 73.66,0 73.66,63.5 20.32,63.5 20.32,36.83 0,36.83
  pour Bottom: 0,0 73.66,0 73.66,63.5 20.32,63.5 20.32,36.83 0,36.83
LED_LEFT  (via drill 0.4)
  Top 0.254: U3.1 40.71,54.39 40.71,53.98 44.12,50.57 47.42,50.57 48.03,49.96 48.03,48.49 v49.53,46.99
  Bottom 0.254: v49.53,46.99 50.8,45.72 IC5.25
LED_POWER  (via drill 0.4)
  Top 0.254: U1.1 30.55,54.39 30.55,53.98 33.73,50.8 v40.64,50.8
  Bottom 0.254: IC5.26 51.45,43.5 51.45,45.89 48.26,49.09 48.26,50.8 v40.64,50.8
LED_RIGHT  (via drill 0.4)
  Top 0.254: U6.1 45.79,54.39 45.79,53.98 49.2,50.57 49.96,50.57 50.8,49.73 50.8,49.33 52.83,47.3 v53.03,47.3
  Bottom 0.254: v53.03,47.3 54.61,45.72 IC5.28
LED_TANK  (via drill 0.4)
  Top 0.254: U2.1 35.63,54.39 35.63,53.98 37.54,52.07 v40.64,52.07
  Bottom 0.254: IC5.27 53.34,46.16 51.03,48.47 51.03,50.57 49.53,52.07 v40.64,52.07
N$1
  Bottom 0.254: LEDS.1 R1.1 31.66,55.46 SJ1.1
N$2
  Bottom 0.254: LEDS.3 R2.1 36.74,55.46 SJ2.1
N$3
  Bottom 0.254: LEDS.5 R3.1 41.82,55.46 SJ3.1
N$4
  Top 0.254: U$3.C 59.56,49.66 U$7.P$1
N$5
  Top 0.254: LEDS.8 46.99,54.78 U6.3
N$6
  Top 0.254: LEDS.6 41.91,54.78 U3.3
N$7
  Top 0.254: BOILER_HEATER.2 25.4,54.78 U4.3
N$8
  Bottom 0.254: U$10.P$1 45.72,45.72 46.99,44.45 IC5.22
N$9
  Bottom 0.254: LEDS.7 R4.1 46.9,55.46 SJ4.1
N$10
  Top 0.152: 14.61,7.62 IC1.2 14.61,13.97 15.88,13.97 IC1.6 | R9.1 16.09,7.62 14.61,7.62 | 14.61,7.62 C1.1
N$11
  Top 0.152: U$16.1 18.35,1.69 R10.2 11.43,1.69 | R11.2 11.43,1.69 | U$17.1 11.43,2.71 11.43,1.69
N$12
  Top 0.152: R11.1 C3.1
N$13
  Top 0.152: 16.51,5.08 R9.2 17.78,5.5 17.78,8.89 16.51,8.89 15.88,9.53 IC1.3 | 16.51,5.08 R10.1 | U$17.3 12.7,5.08 16.51,5.08
N$14
  Top 0.152: U$16.3 23.88,4.91 R12.2 R13.2
N$16
  Top 0.152: 24.13,13.12 R16.2
  Top 0.2: U$2.3 23.49,13.12 24.13,13.12 | R15.1 R16.2
  Top 0.203: R16.2 R14.2
N$19
  Bottom 0.254: U$9.P$1 49.53,44.83 IC5.24
N$21
  Top 0.254: LEDS.4 36.83,54.78 U2.3
N$22
  Bottom 0.254: U$3.TX0 U$5.P$1
N$23
  Top 0.254: LEDS.2 31.75,54.78 U1.3
N$24
  Top 0.254: JP3.8 69.09,59.33 68.38,58.62 68.28,58.52 67.82,58.06 Q1.3
N$26
  Bottom 0.254: U$11.P$1 U$3.RX0
N$31
  Bottom 0.254: U$6.P$1 49.53,50.55 U$3.D5
N$32
  Top 0.2: 69.85,16.26 69.85,10.03
  Top 0.254: R21.2 R20.1 C4.1 69,17.11 69.72,16.38 69.85,16.26 | 69.85,10.03 FLOW_RET.3
N$33
  Top 0.254: R24.2 R23.1 C5.1 69,10.58 FLOW_PUMP.3
N$44
  Bottom 0.254: U$3.D15 U$8.P$1
N$52
  Top 0.254: U$3.D34 U$12.P$1
N$56
  Top 0.254: U$3.D25 U$13.P$1
N$57
  Top 0.254: U$3.D26 U$14.P$1
PROBE
  Top 0.254: PROBE.1 C3.2
PUMP
  Bottom 0.254: SSR_CARD.2 54.61,52.07 55.88,50.8 55.88,46.26 56.26,45.88 56.26,41.02 52.07,36.83 IC5.3
SCL  (via drill 0.4)
  Top 0.254: U$3.D22 31.75,45.72 v35.56,41.91 v34.29,40.64 | U5.10 58.14,12.42 v58.42,12.7 | v43.18,21.59 41.68,23.09 41.48,23.09 40.87,23.7 40.87,24.56 40.89,24.58 40.89,30.99 v41.02,30.99
  Bottom 0.254: v35.56,41.91 40.64,36.83 IC5.12 40.64,31.37 v41.02,30.99 | R17.1 v34.29,40.64 | v58.42,12.7 55.88,15.24 53.34,15.24 46.99,21.59 v43.18,21.59
SDA  (via drill 0.4)
  Top 0.254: v35.56,48.26 38.1,48.26 U$3.D21 | U5.9 57.62,10.56 57.62,11.36 57.15,11.83 v57.15,12.7 | v40.31,30.37 40.31,24.66 40.41,24.56 40.41,23.09 v43.18,20.32
  Bottom 0.254: 34.29,43.18 34.29,41.91 39.37,36.83 IC5.13 39.37,31.31 v40.31,30.37 | 34.29,43.18 34.29,46.99 v35.56,48.26 | R18.1 34.29,43.18 | v43.18,20.32 47.72,20.32 53.18,14.86 54.99,14.86 v57.15,12.7
TANK_SENSOR  (via drill 0.4)
  Top 0.254: TANK_SENSOR.2 47.84,14.82 R26.2 49.53,15.03 51.01,16.51 51.01,34.08 v48.26,36.83
  Bottom 0.254: v48.26,36.83 45.72,39.37 IC5.21
TEMP_BOILER
  Top 0.254: TEMP_BOILER.2 35.56,5.08 35.56,40.64 U$3.D19
TEMP_BU
  Top 0.254: U$3.D4 56.41,48.79 56.41,48.78 45.72,38.09 45.72,19.05 41.91,15.24 41.91,12.7 40.64,11.43 38.1,11.43 36.83,10.16 TEMP_BU.2
TEMP_TUBE
  Top 0.254: TEMP_TUBE.2 36.83,19.05 38.1,20.32 38.1,25.4 36.83,26.67 36.83,39.37 U$3.D18

### Text on the board
tDocu: 5V | GND | CS | reset | DC | SDI | SCK | LED | SDO | 230V | Display | + | boiler / heater | + | LED / power | + | LED / tank | + | LED / left | + | LED / right | BU / heater | pump | BU / valve | boiler / valve | GND | 5V | SSR card | ESP32 | tank | GND | probe | + | tube | NTC spare | NTC boiler | + | BU | + | + | + | boiler | pump | return | button / left | 3.3V | button / right | 3.3V | button / brew / vol | 3.3V | button / brew / man | 3.3V